# Altium schematic sheet 106729.SchDoc: EAX3500 PROGRAMMING BOARD
size OrCAD A; Date: 08/03/2016; ApprovedBy: DMH; CheckedBy: DMH; Author: DMH; CompanyName: Detex Corp; DrawnBy: DMH; Engineer: DMH; Organization: Detex Corp; Address1: 302 Detex Dr; Address2: New Braunfels, TX 78130; DocumentNumber: 106729; Revision: A0; SheetNumber: 1; SheetTotal: 1; =VersionControl_RevNumber: A0; DocumentFullPathAndName: EAX3500 PROGRAMMING BOARD; DocumentName: EAX3500 PROGRAMMING BOARD; ProjectName: EAX3500 PROGRAMMING BOARD
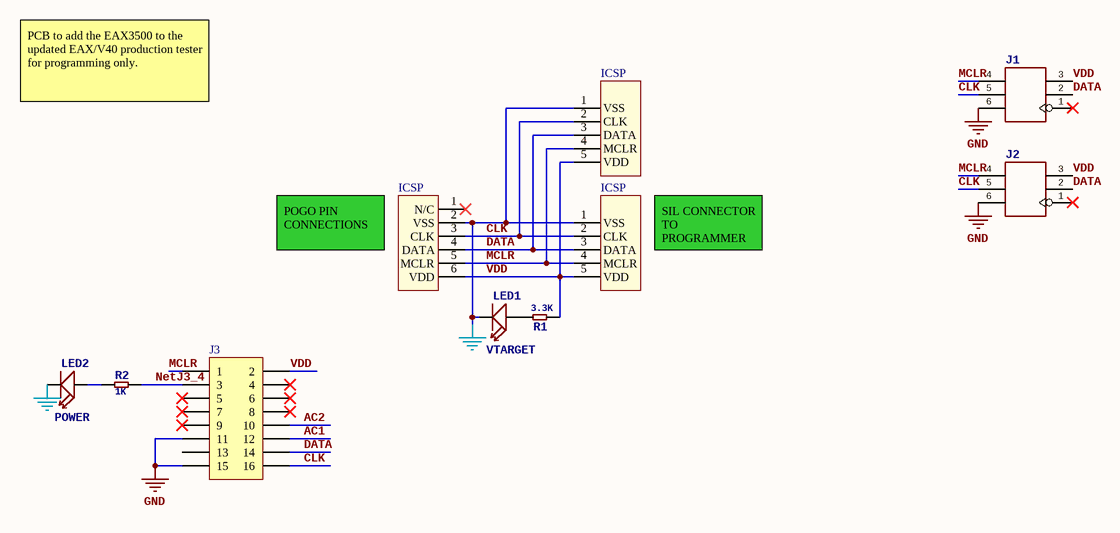
[diagram p0: 106729.SchDoc]

## Parts
ICSP  ICSP  [ICSP]  (value not drawn)
J1  320020077  [H2X3-2.54]  (value not drawn)
J2  320020077  [H2X3-2.54]  (value not drawn)
J3  MHDR2X8  [16C_2P HEADER]  (value not drawn)
LED1  VTARGET  [LED2-2.54-D3.0MM]
LED2  POWER  [LED2-2.54-D3.0MM]
R1  value 3.3K  [RESC1206(3216)_N]  (hidden comment: 301020010)
R2  value 1K  [RESC1206(3216)_N]  (hidden comment: 301020010)
SIL  ICSP  [SIP5]
SIL2  ICSP  [SIP5]

## Nets
GND: ICSP.2(VSS) J1.6 J2.6 J3.11 J3.15 LED1.K(-) LED2.K(-) SIL.1(VSS) SIL2.1(VSS)
AC1: J3.12
AC2: J3.10
CLK: ICSP.3(CLK) J1.5 J2.5 J3.16 SIL.2(CLK) SIL2.2(CLK)
DATA: ICSP.4(DATA) J1.2 J2.2 J3.14 SIL.3(DATA) SIL2.3(DATA)
MCLR: ICSP.5(MCLR) J1.4 J2.4 J3.1 SIL.4(MCLR) SIL2.4(MCLR)
NetJ3_4: J3.3 R2.2
VDD: ICSP.6(VDD) J1.3 J2.3 J3.2 R1.2 SIL.5(VDD) SIL2.5(VDD)
NetLED1_A: LED1.A(+) R1.1
NetLED2_A: LED2.A(+) R2.1

Not connected (* = marked no-connect by the designer): ICSP 1(N/C)*; J1 1*; J2 1*; J3 4* 5* 6* 7* 8* 9* 13

## Notes on the sheet
- PCB to add the EAX3500 to the updated EAX/V40 production tester for programming only.
- POGO PIN CONNECTIONS
- SIL CONNECTOR TO PROGRAMMER
- Project:
- Engineer:
- Date:
- Time:
- Number:
- Revision:
- Sheet
- of
- 302 Detex Drive
- New Braunfels, TX 78130
- (830) 629-2900
- File Name:

## Library data of the parts
ICSP SIL SIL2 = ICSP: In-Circuit Serial Programming Header
J1 J2 = DIP-BLACK-MALE-HEADER(2X3P-2.54）-2.54: MPN: P125-12A1BS116A1
LED1 LED2 = DIP-LED-RED-RED(2P-D3MM): MPN: SR302DC
R1 R2 = DIP-RES-2.2K-5%-1/4W(PR-D2.3XL6.5MM): MPN: FHCFR-1/4W-222J